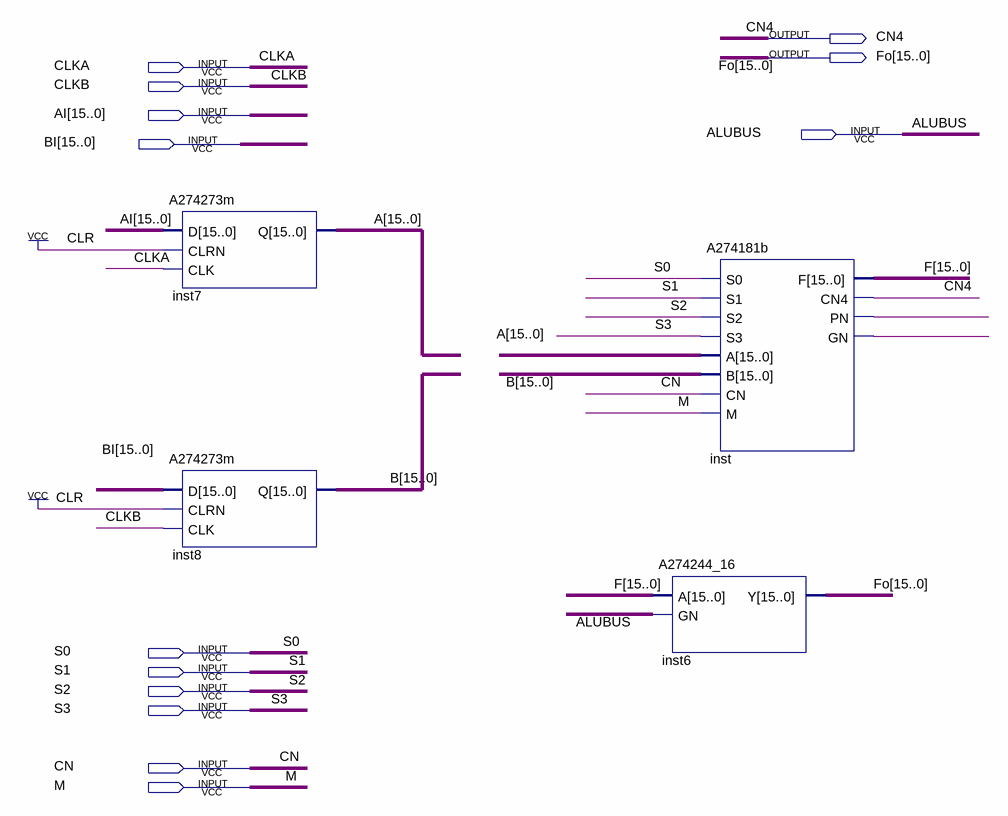
[diagram p0: schematic sheet]
// Quartus schematic A2ADD16b.bdf as structural Verilog: 4 symbols, 13 pins
module A2ADD16b (
  input  CLKA,
  input  CLKB,
  input  [15:0] AI,
  input  ALUBUS,
  input  [15:0] BI,
  input  S0,
  input  S1,
  input  S2,
  input  S3,
  input  CN,
  input  M,
  output CN4,
  output [15:0] Fo
);

  wire inst_gn, inst_pn;
  wire [15:0] A, B, F;

  A274273m inst7 (.D(AI), .CLRN(1'b1), .CLK(CLKA), .Q(A));
  A274273m inst8 (.D(BI), .CLRN(1'b1), .CLK(CLKB), .Q(B));
  A274244_16 inst6 (.A(F), .GN(ALUBUS), .Y(Fo));
  A274181b inst (
    .S0(S0), .S1(S1), .S2(S2), .S3(S3), .A(A), .B(B), .CN(CN), .M(M), .F(F), .CN4(CN4), .PN(inst_pn),
    .GN(inst_gn));
endmodule
